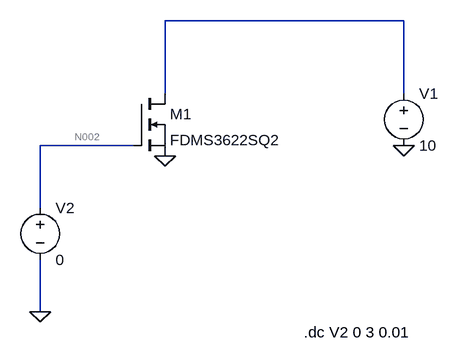
[diagram p0: schematic Draft2.asc]
Draft2.asc, the LTspice schematic file:
Version 4
SHEET 1 880 680
WIRE 608 -16 240 -16
WIRE 240 96 240 -16
WIRE 608 96 608 -16
WIRE 192 176 48 176
WIRE 48 272 48 176
WIRE 48 432 48 352
FLAG 608 176 0
FLAG 240 192 0
FLAG 48 432 0
SYMBOL nmos 192 96 R0
SYMATTR InstName M1
SYMATTR Value FDMS3622SQ2
SYMBOL voltage 608 80 R0
SYMATTR InstName V1
SYMATTR Value 10
SYMBOL voltage 48 256 R0
WINDOW 123 0 0 Left 0
WINDOW 39 0 0 Left 0
SYMATTR InstName V2
SYMATTR Value 0
TEXT 454 464 Left 2 !.dc V2 0 3 0.01

The netlist it stands for:
* Draft2.asc
M1 N001 N002 0 0 FDMS3622SQ2
V1 N001 0 10
V2 N002 0 0
.model NMOS NMOS
.model PMOS PMOS
.lib standard.mos
.dc V2 0 3 0.01
.backanno
.end

* Results of the author's LTspice run, read from the files saved beside the schematic
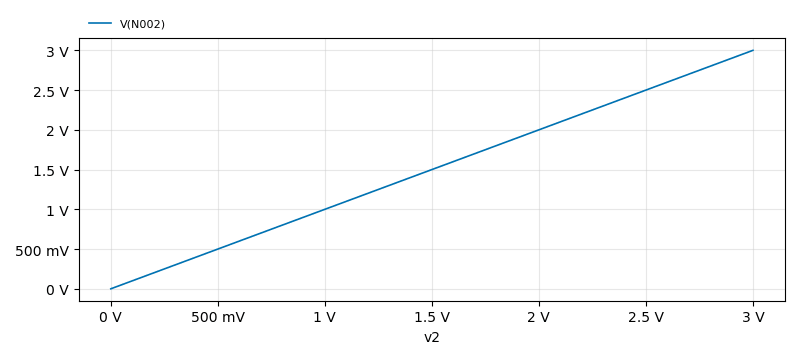
[diagram p1: DC transfer characteristic of Draft2.asc, plotted from the saved traces]
* DC transfer characteristic, 1 run:
*   V(N002): 0 V at v2=0 V, 3 V at v2=3 V, min 0 V, max 3 V